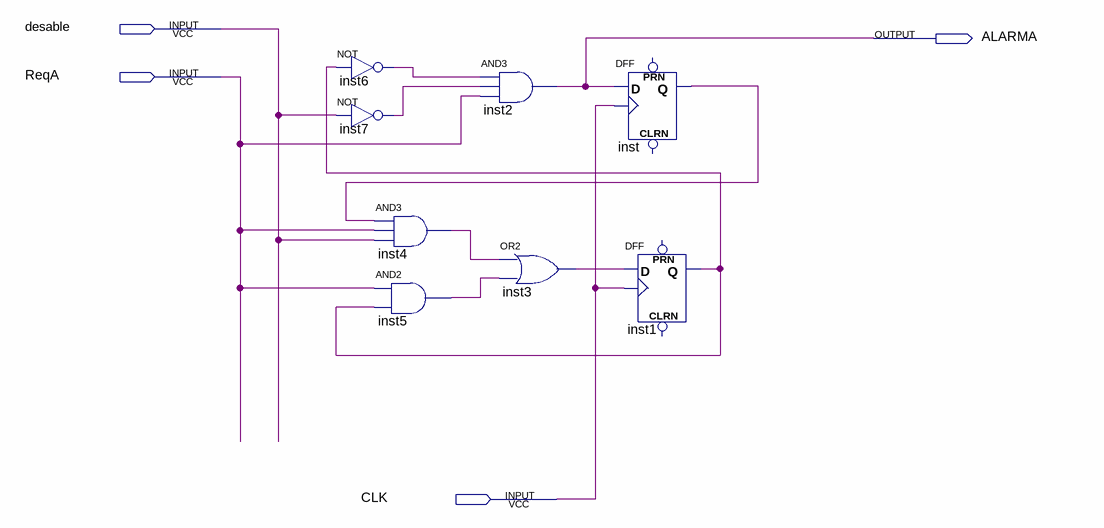
[diagram p0: schematic sheet]
// Quartus schematic desable_alarm.bdf as structural Verilog: 8 symbols, 4 pins
module desable_alarm (
  input  desable,
  input  ReqA,
  input  CLK,
  output ALARMA
);

  wire inst1_q, inst3_out, inst4_out, inst5_out, inst6_out, inst7_out, inst_q;

  not inst6 (inst6_out, inst1_q);
  not inst7 (inst7_out, desable);
  and inst4 (inst4_out, inst_q, ReqA, desable);
  and inst5 (inst5_out, ReqA, inst1_q);
  and inst2 (ALARMA, inst6_out, inst7_out, ReqA);
  or inst3 (inst3_out, inst4_out, inst5_out);
  DFF inst (.CLK(CLK), .D(ALARMA), .Q(inst_q));  // open: CLRN, PRN
  DFF inst1 (.CLK(CLK), .D(inst3_out), .Q(inst1_q));  // open: CLRN, PRN
endmodule
